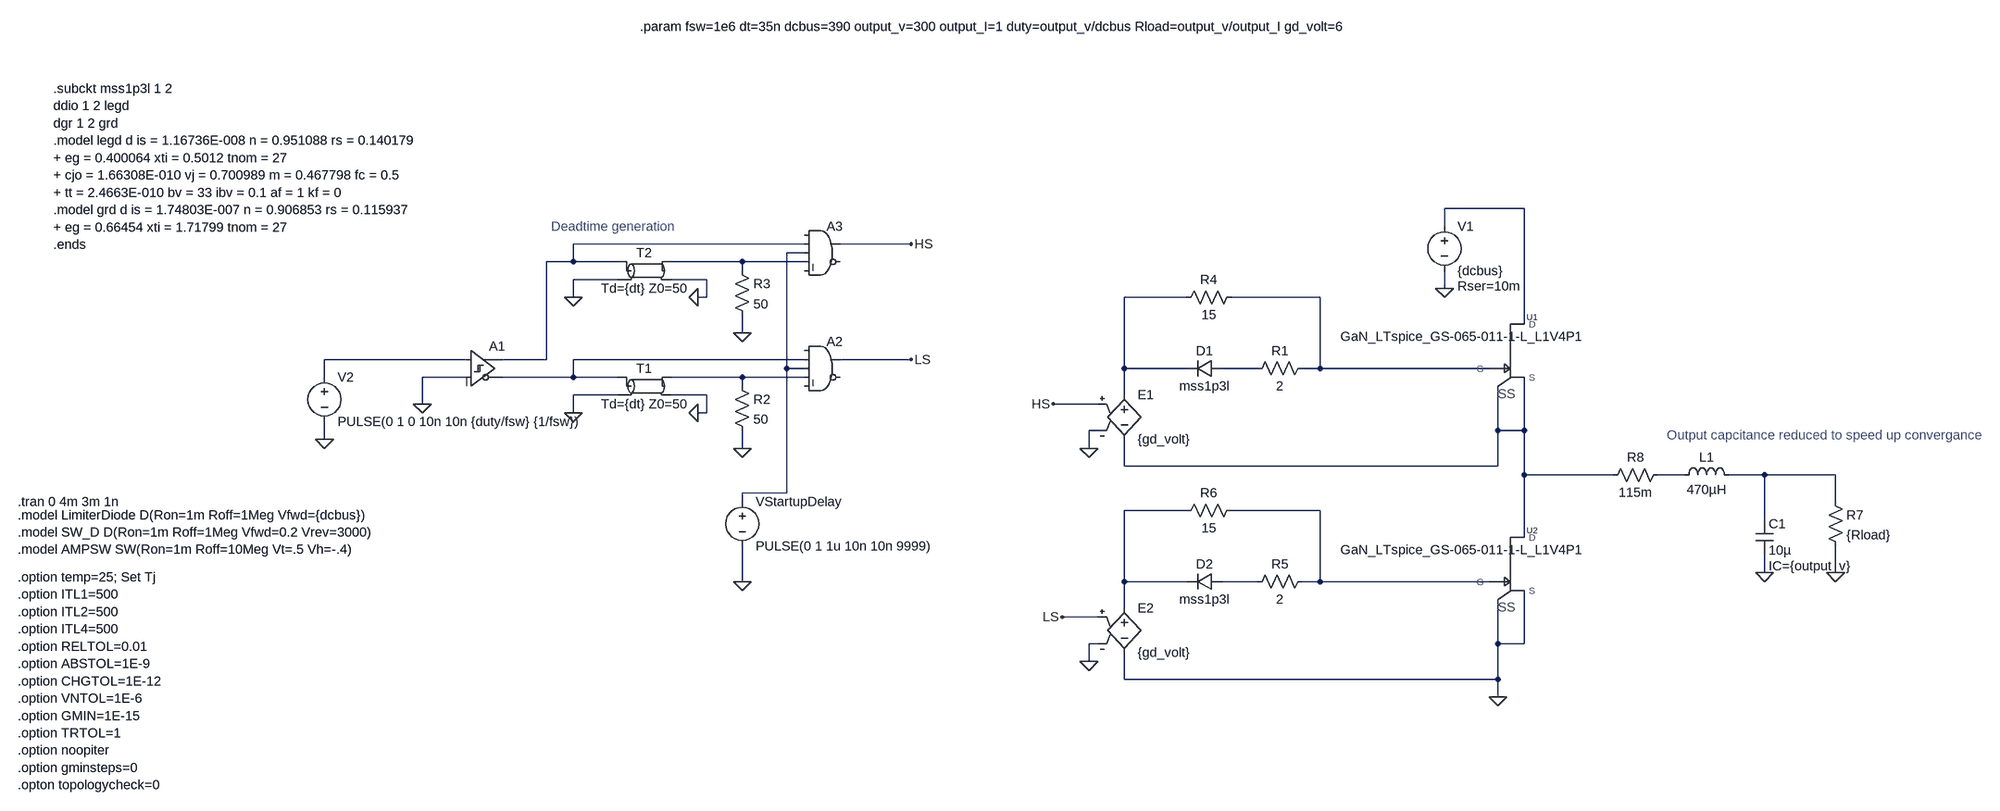
[diagram p0: schematic PWR_STAGE_LOSS.asc]
PWR_STAGE_LOSS.asc, the LTspice schematic file:
Version 4
SHEET 1 1804 1252
WIRE 256 96 112 96
WIRE 112 128 112 96
WIRE -1040 160 -1456 160
WIRE -848 160 -976 160
WIRE -1040 176 -1072 176
WIRE -1456 192 -1456 160
WIRE -1456 192 -1504 192
WIRE -1376 192 -1456 192
WIRE -1152 192 -1280 192
WIRE -1040 192 -1152 192
WIRE -1152 208 -1152 192
WIRE -1376 224 -1456 224
WIRE -1216 224 -1280 224
WIRE 112 240 112 208
WIRE -1456 256 -1456 224
WIRE -1216 256 -1216 224
WIRE -1216 256 -1232 256
WIRE -352 256 -464 256
WIRE -112 256 -272 256
WIRE 256 304 256 96
WIRE -1152 320 -1152 288
WIRE -1648 368 -1904 368
WIRE -1504 368 -1504 192
WIRE -1504 368 -1584 368
WIRE -1040 368 -1456 368
WIRE -848 368 -976 368
WIRE -1072 384 -1072 176
WIRE -1040 384 -1072 384
WIRE -464 384 -464 256
WIRE -352 384 -464 384
WIRE -224 384 -288 384
WIRE -112 384 -112 256
WIRE -112 384 -144 384
WIRE 192 384 -112 384
WIRE -1904 400 -1904 368
WIRE -1648 400 -1728 400
WIRE -1456 400 -1456 368
WIRE -1456 400 -1584 400
WIRE -1376 400 -1456 400
WIRE -1152 400 -1280 400
WIRE -1040 400 -1152 400
WIRE -1152 416 -1152 400
WIRE -1376 432 -1456 432
WIRE -1216 432 -1280 432
WIRE -464 432 -464 384
WIRE -1728 448 -1728 400
WIRE -512 448 -592 448
WIRE -1456 464 -1456 432
WIRE -1216 464 -1216 432
WIRE -1216 464 -1232 464
WIRE -512 496 -528 496
WIRE 208 496 208 416
WIRE 256 496 256 400
WIRE 256 496 208 496
WIRE -1904 512 -1904 480
WIRE -1152 528 -1152 496
WIRE -528 528 -528 496
WIRE -464 560 -464 512
WIRE 208 560 208 496
WIRE 208 560 -464 560
WIRE 256 576 256 496
WIRE 416 576 256 576
WIRE 544 576 496 576
WIRE 688 576 624 576
WIRE 816 576 688 576
WIRE -1072 608 -1072 384
WIRE -1072 608 -1152 608
WIRE -1152 624 -1152 608
WIRE 816 624 816 576
WIRE -352 640 -464 640
WIRE -112 640 -272 640
WIRE 688 656 688 576
WIRE 256 688 256 576
WIRE 688 752 688 720
WIRE 816 752 816 704
WIRE -1152 768 -1152 704
WIRE -464 768 -464 640
WIRE -352 768 -464 768
WIRE -224 768 -288 768
WIRE -112 768 -112 640
WIRE -112 768 -144 768
WIRE 192 768 -112 768
WIRE -464 816 -464 768
WIRE -512 832 -576 832
WIRE -512 880 -528 880
WIRE 208 880 208 800
WIRE 256 880 256 784
WIRE 256 880 208 880
WIRE -528 912 -528 880
WIRE -464 944 -464 896
WIRE 208 944 208 880
WIRE 208 944 -464 944
WIRE 208 976 208 944
FLAG -1456 464 0
FLAG -1232 464 0
FLAG -1152 528 0
FLAG -1456 256 0
FLAG -1232 256 0
FLAG -1152 320 0
FLAG -848 160 HS
FLAG -848 368 LS
FLAG -1152 768 0
FLAG -528 528 0
FLAG -528 912 0
FLAG 208 976 0
FLAG 112 240 0
FLAG 688 752 0
FLAG -576 832 LS
FLAG -592 448 HS
FLAG 816 752 0
FLAG -1728 448 0
FLAG -1904 512 0
SYMBOL tline -1328 416 R0
SYMATTR InstName T1
SYMATTR Value Td={dt} Z0=50
SYMBOL res -1168 400 R0
SYMATTR InstName R2
SYMATTR Value 50
SYMBOL Digital\\and -1008 320 R0
SYMATTR InstName A2
SYMBOL tline -1328 208 R0
SYMATTR InstName T2
SYMATTR Value Td={dt} Z0=50
SYMBOL res -1168 192 R0
SYMATTR InstName R3
SYMATTR Value 50
SYMBOL Digital\\and -1008 112 R0
SYMATTR InstName A3
SYMBOL voltage -1152 608 R0
WINDOW 123 0 0 Left 0
WINDOW 39 0 0 Left 0
SYMATTR InstName VStartupDelay
SYMATTR Value PULSE(0 1 1u 10n 10n 9999)
SYMBOL GaNSystems\\GaN_LTspice_GS-065-011-1-L_L1V4P1 208 352 R0
SYMATTR InstName U1
SYMBOL diode -288 368 R90
WINDOW 0 0 32 VBottom 2
WINDOW 3 32 32 VTop 2
SYMATTR InstName D1
SYMATTR Value mss1p3l
SYMATTR Prefix x
SYMBOL res -128 368 R90
WINDOW 0 0 56 VBottom 2
WINDOW 3 32 56 VTop 2
SYMATTR InstName R1
SYMATTR Value 2
SYMBOL res -256 240 R90
WINDOW 0 0 56 VBottom 2
WINDOW 3 32 56 VTop 2
SYMATTR InstName R4
SYMATTR Value 15
SYMBOL e -464 416 R0
SYMATTR InstName E1
SYMATTR Value {gd_volt}
SYMBOL GaNSystems\\GaN_LTspice_GS-065-011-1-L_L1V4P1 208 736 R0
SYMATTR InstName U2
SYMBOL diode -288 752 R90
WINDOW 0 0 32 VBottom 2
WINDOW 3 32 32 VTop 2
SYMATTR InstName D2
SYMATTR Value mss1p3l
SYMATTR Prefix x
SYMBOL res -128 752 R90
WINDOW 0 0 56 VBottom 2
WINDOW 3 32 56 VTop 2
SYMATTR InstName R5
SYMATTR Value 2
SYMBOL res -256 624 R90
WINDOW 0 0 56 VBottom 2
WINDOW 3 32 56 VTop 2
SYMATTR InstName R6
SYMATTR Value 15
SYMBOL e -464 800 R0
SYMATTR InstName E2
SYMATTR Value {gd_volt}
SYMBOL voltage 112 112 R0
WINDOW 123 0 0 Left 0
WINDOW 39 24 124 Left 2
SYMATTR InstName V1
SYMATTR Value {dcbus}
SYMATTR SpiceLine Rser=10m
SYMBOL ind 528 592 R270
WINDOW 0 32 56 VTop 2
WINDOW 3 5 56 VBottom 2
SYMATTR InstName L1
SYMATTR Value 470µH
SYMBOL cap 672 656 R0
WINDOW 123 24 84 Left 2
SYMATTR InstName C1
SYMATTR Value 10µ
SYMATTR Value2 IC={output_v}
SYMBOL res 800 608 R0
SYMATTR InstName R7
SYMATTR Value {Rload}
SYMBOL Digital\\diffschmitt -1648 320 R0
SYMATTR InstName A1
SYMBOL voltage -1904 384 R0
WINDOW 123 0 0 Left 0
WINDOW 39 0 0 Left 0
SYMATTR InstName V2
SYMATTR Value PULSE(0 1 0 10n 10n {duty/fsw} {1/fsw})
SYMBOL res 512 560 R90
WINDOW 0 0 56 VBottom 2
WINDOW 3 32 56 VTop 2
SYMATTR InstName R8
SYMATTR Value 115m
TEXT -2456 624 Left 2 !.tran 0 4m 3m 1n
TEXT -2456 648 Left 2 !.model LimiterDiode D(Ron=1m Roff=1Meg Vfwd={dcbus})\n.model SW_D D(Ron=1m Roff=1Meg Vfwd=0.2 Vrev=3000)\n.model AMPSW SW(Ron=1m Roff=10Meg Vt=.5 Vh=-.4)
TEXT -1336 -232 Left 2 !.param fsw=1e6 dt=35n dcbus=390 output_v=300 output_I=1 duty=output_v/dcbus Rload=output_v/output_I gd_volt=6
TEXT -1496 128 Left 2 ;Deadtime generation
TEXT -2456 760 Left 2 !.option temp=25; Set Tj\n.option ITL1=500\n.option ITL2=500\n.option ITL4=500\n.option RELTOL=0.01\n.option ABSTOL=1E-9\n.option CHGTOL=1E-12\n.option VNTOL=1E-6\n.option GMIN=1E-15\n.option TRTOL=1\n.option noopiter\n.option gminsteps=0\n.opton topologycheck=0
TEXT -2392 -120 Left 2 !.subckt mss1p3l 1 2\nddio 1 2 legd\ndgr 1 2 grd\n.model legd d is = 1.16736E-008 n = 0.951088 rs = 0.140179\n+ eg = 0.400064 xti = 0.5012 tnom = 27\n+ cjo = 1.66308E-010 vj = 0.700989 m = 0.467798 fc = 0.5\n+ tt = 2.4663E-010 bv = 33 ibv = 0.1 af = 1 kf = 0\n.model grd d is = 1.74803E-007 n = 0.906853 rs = 0.115937\n+ eg = 0.66454 xti = 1.71799 tnom = 27\n.ends
TEXT 512 504 Left 2 ;Output capcitance reduced to speed up convergance

The netlist it stands for:
* PWR_STAGE_LOSS.asc
T1 N008 0 N010 0 Td={dt} Z0=50
R2 N010 0 50
A2 0 N008 N003 N010 0 0 LS 0 AND
T2 N002 0 N004 0 Td={dt} Z0=50
R3 N004 0 50
A3 0 N002 N003 N004 0 0 HS 0 AND
VStartupDelay N003 0 PULSE(0 1 1u 10n 10n 9999)
XU1 N006 N001 N011 N011 GaN_LTspice_GS-065-011-1-L_L1V4P1  ; pins G D S SS
XD1 N009 N005 mss1p3l  ; pins + -
R1 N006 N009 2
R4 N006 N005 15
E1 N005 N011 HS 0 {gd_volt}
XU2 N015 N011 0 0 GaN_LTspice_GS-065-011-1-L_L1V4P1  ; pins G D S SS
XD2 N016 N014 mss1p3l  ; pins + -
R5 N015 N016 2
R6 N015 N014 15
E2 N014 0 LS 0 {gd_volt}
V1 N001 0 {dcbus} Rser=10m
L1 N012 N013 470µH
C1 N013 0 10µ IC={output_v}
R7 N013 0 {Rload}
A1 N007 0 0 0 0 N008 N002 0 SCHMITT
V2 N007 0 PULSE(0 1 0 10n 10n {duty/fsw} {1/fsw})
R8 N012 N011 115m
.tran 0 4m 3m 1n
.model LimiterDiode D(Ron=1m Roff=1Meg Vfwd={dcbus})
.model SW_D D(Ron=1m Roff=1Meg Vfwd=0.2 Vrev=3000)
.model AMPSW SW(Ron=1m Roff=10Meg Vt=.5 Vh=-.4)
.param fsw=1e6 dt=35n dcbus=390 output_v=300 output_I=1 duty=output_v/dcbus Rload=output_v/output_I gd_volt=6
* Deadtime generation
.option temp=25; Set Tj
.option ITL1=500
.option ITL2=500
.option ITL4=500
.option RELTOL=0.01
.option ABSTOL=1E-9
.option CHGTOL=1E-12
.option VNTOL=1E-6
.option GMIN=1E-15
.option TRTOL=1
.option noopiter
.option gminsteps=0
.opton topologycheck=0
.subckt mss1p3l 1 2
ddio 1 2 legd
dgr 1 2 grd
.model legd d is = 1.16736E-008 n = 0.951088 rs = 0.140179
+ eg = 0.400064 xti = 0.5012 tnom = 27
+ cjo = 1.66308E-010 vj = 0.700989 m = 0.467798 fc = 0.5
+ tt = 2.4663E-010 bv = 33 ibv = 0.1 af = 1 kf = 0
.model grd d is = 1.74803E-007 n = 0.906853 rs = 0.115937
+ eg = 0.66454 xti = 1.71799 tnom = 27
.ends
* Output capcitance reduced to speed up convergance
.lib GaN_LTspice_GS-065-011-1-L_L1V4P1.lib
.backanno
.end